# EAGLE design Pluvion 2 (EAGLE 7.3.0)

## Sheet 1 of 3
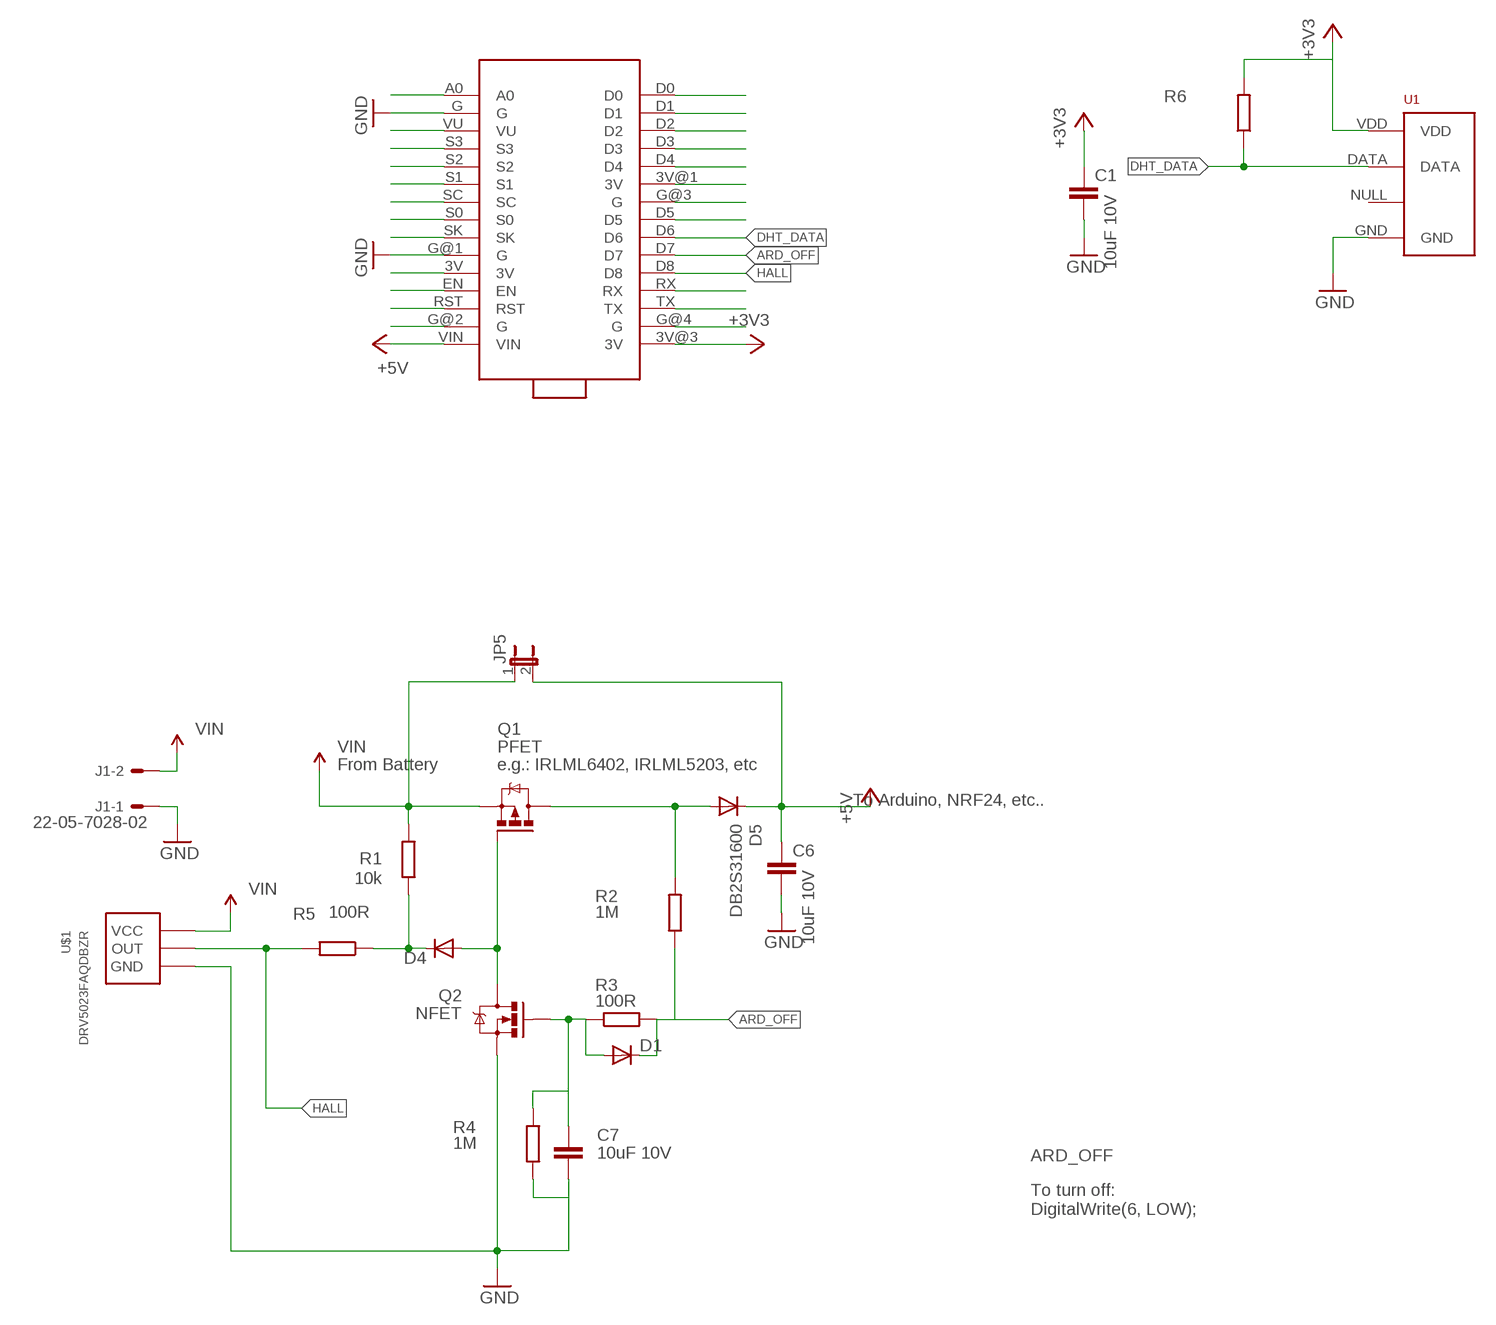
[diagram p0: schematic, sheet 1]

### Parts
C1  10uF 10V  C-EUC0805  [C0805]
C6  10uF 10V  C-EUC0805  [C0805]
C7  10uF 10V  C-EUC0805  [C0805]
D1  DIODESOD  [SOD-323]
D4  DIODESOD  [SOD-323]
D5  DB2S31600  DIODESMA  [SMA-DIODE]
J1  22-05-7028-02  [7395-02]
JP5  JUMPER-2PTH  [1X02]
Q1  PFET  IRLML5203  [MICRO3]
Q2  NFET  MOSFET-NCHANNELBSS123LT1G  [SOT23]
R1  10k  R-EU_R0805  [R0805]
R2  1M  R-EU_R0805  [R0805]
R3  100R  R-EU_R0805  [R0805]
R4  1M  R-EU_R0805  [R0805]
R5  100R  R-EU_R0805  [R0805]
R6  R-EU_R0805  [R0805]
U1  RHT03_DHT-22_AM2302RA  [RHT03_DHT-22/RA]
U$1  DRV5023FAQDBZR  [SOT23]
U$2  NODE-LOLIN-ESP8266  [NODE-LOLIN-ESP8266]

### Nets
+3V3: C1.1 R6.2 U1.VDD U$2.3V@3(3V)
+5V: C6.1 D5.C JP5.2 U$2.VIN
ARD_OFF: D1.1(C) R2.1 R3.2 U$2.D7
BUTTONS: D4.2(A) Q1.1(G) Q2.3(D)
DHT_DATA: R6.1 U1.DATA U$2.D6
GND: C1.2 C6.2 C7.2 J1.1 Q2.2(S) R4.1 U1.GND U$1.3(GND) U$2.G U$2.G@1(G)
HALL: R5.2 U$1.2(OUT) U$2.D8
N$1: D5.A Q1.3(D) R2.2
N$2: C7.1 D1.2(A) Q2.1(G) R3.1 R4.2
N$3: U$2.D0
N$4: U$2.D1
N$5: U$2.D2
N$6: U$2.D3
N$7: U$2.D4
N$8: D4.1(C) R1.1 R5.1
N$11: U$2.D5
N$12: U$2.G@3(G)
N$13: U$2.G@4(G)
N$14: U$2.3V@1(3V)
N$15: U$2.RX
N$16: U$2.TX
N$17: U$2.3V
N$19: U$2.A0
N$21: U$2.VU
N$22: U$2.S3
N$23: U$2.S2
N$24: U$2.S1
N$25: U$2.SC
N$26: U$2.S0
N$27: U$2.SK
N$30: U$2.EN
N$31: U$2.RST
N$32: U$2.G@2(G)
VIN: J1.2 JP5.1 Q1.2(S) R1.2 U$1.1(VCC)
Unconnected: U1.NULL

### Notes on the sheet
- From Battery | e.g.: IRLML6402, IRLML5203, etc
- To Arduino, NRF24, etc..
- To turn off:
  DigitalWrite(6, LOW);

## Sheet 2 of 3

## Sheet 3 of 3

## Library data of the parts
C1 C6 C7 = wes:C-EU: CAPACITOR, European symbol
D1 D4 = SparkFun-DiscreteSemi:DIODE: Diode These are standard reverse protection diodes and small signal diodes. SMA package can handle up to about 1A. SOD-323 can handle about 200mA. What the SOD-323 package when ordering, there are some mfgs out there that are 5-pin packages.; PROD_ID: DIO-09646
D5 = SparkFun-DiscreteSemi:DIODE: Diode These are standard reverse protection diodes and small signal diodes. SMA package can handle up to about 1A. SOD-323 can handle about 200mA. What the SOD-323 package when ordering, there are some mfgs out there that are 5-pin packages.
J1 = con-molex:22-?-02: CONNECTOR wire to board 2.54 mm (.1 inch) pitch header; OC_FARNELL: 9731601; OC_NEWARK: unknown
JP5 = SparkFun-Passives:JUMPER-2: Jumper Basic 0.1" spaced jumper. Use with breakaway headers.
Q1 = transistor-power:IRLML5203: HEXFET P-Channel Power MOSFET
Q2 = SparkFun-DiscreteSemi:MOSFET-NCHANNEL: Common NMOSFET Parts MFG P/N Store ID Prod ID FDD8780 TRANS-09984 SI7820DN TRANS-11055 FDS6630A IC-08089 2N7002PW TRANS-11151 FQP30N06L COM-10213 TRANS-10060 BSS123LT1G TRANS-08345 BSS138 TRANS-00830 BS170 2N7000; PROD_ID: TRANS-08345
R1-R6 = wes:R-EU_: RESISTOR, European symbol
U1 = RHT03_DHT-22_AM2302:RHT03_DHT-22_AM2302: RHT03 / DHT-22 / AM2302 Packages and symbol for the RHT03 / DHT-22 relative humidity and temperature sensor. Note: The AM2302 is a wired version of the DHT-22 which typically requires less clearance and is thus provided as a separate package.; PROD_ID: SEN-10167
U$1 = lib_pluvion:DRV5023FAQDBZR: Digital Switch Hall Sensor
U$2 = wes:NODE-LOLIN-ESP8266

## Board
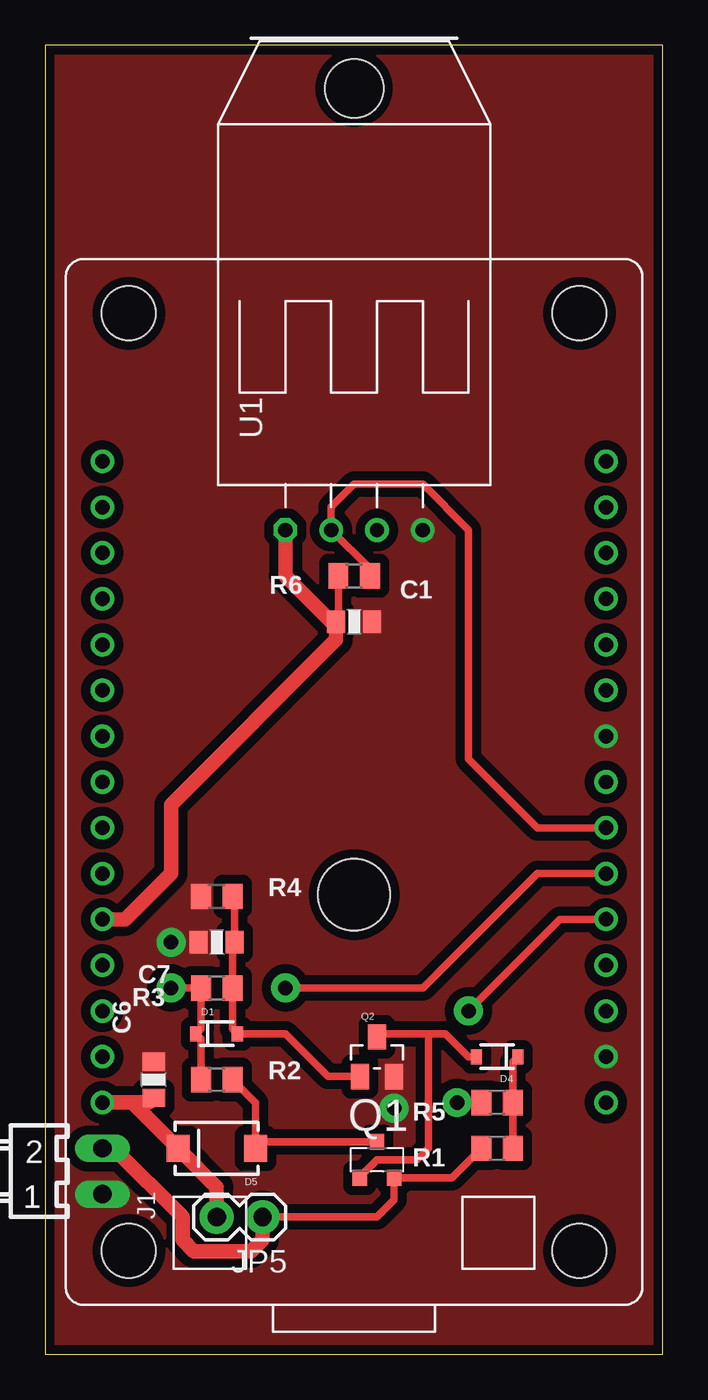
[diagram p1: board, top side]
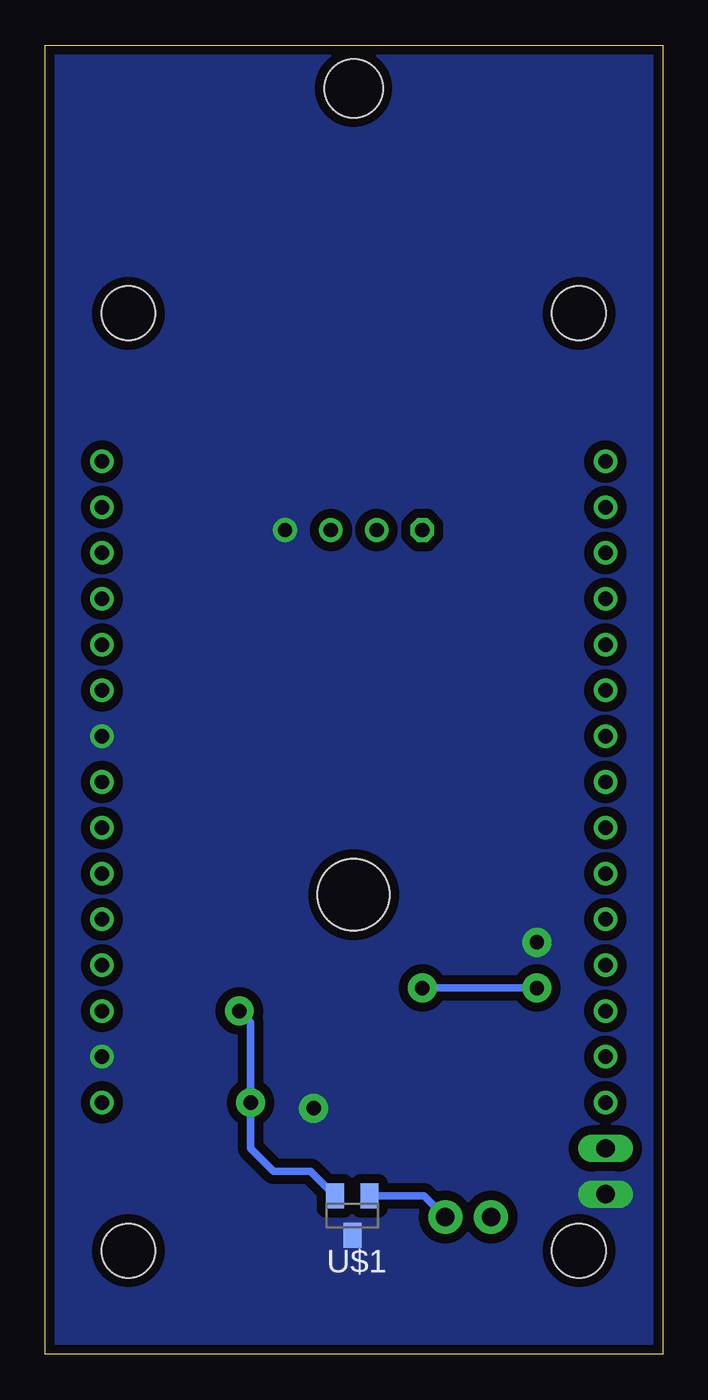
[diagram p2: board, bottom side, seen from below]

Size 34.27 x 72.62 mm. Coordinates in mm from the lower left corner, seen from the top.
Outline: 0,0 34.27,0 34.27,72.62 0,72.62 0,0
Copper layers (1*16): Top 0.035mm / dielectric 1.5mm / Bottom 0.035mm
Design rules "default *": minimum track width 10mil, minimum drill 0.6mm, track to track 8mil, track to pad 8mil, pad to pad 8mil, via to via 8mil, smd to smd 8mil, copper to edge 10mil, drill to drill 8mil, minimum pad ring 10mil, minimum via ring 8mil, stop-mask expansion 4mil, vias tented up to drill 0mil, thermal gap 10mil
Holes 4 mm at 17.14,25.5

### Footprints (pad centres in the part's own frame; a part is rotated, then mirrored left to right if it is on the bottom)
C0805 = smd 1 x 1.25: 1 -1,0; 2 1,0
SOD-323 = smd 0.63 x 0.83: 1 -1.15,0; 2 1.15,0
SMA-DIODE = smd 1.27 x 1.47: A -2.15,0; C 2.15,0
7395-02 = drill 1.016 long: 1 1.27,0; 2 -1.27,0
1X02 = drill 1.016 pad 1.88: 1 0,0; 2 2.54,0
MICRO3 = smd 0.8 x 0.9: 1 -0.95,-1; 2 0.95,-1; 3 0,1
SOT23 = smd 1 x 1.4: 1 -0.95,-1.1; 2 0.95,-1.1; 3 0,1.1
R0805 = smd 1.1 x 1.4: 1 -0.875,0; 2 0.875,0
RHT03_DHT-22/RA = drill 0.8: DATA -1.27,0; GND 3.81,0; NULL 1.27,0 | drill 0.8 octagon: VDD -3.81,0 | hole 3.25: 0,24.5
NODE-LOLIN-ESP8266 = drill 0.8: 3V -13.97,17.78; 3V@1 -13.97,-5.08; 3V@3 13.97,7.62; A0 13.97,-17.78; D0 -13.97,-17.78; D1 -13.97,-15.24; D2 -13.97,-12.7; D3 -13.97,-10.16; D4 -13.97,-7.62; D5 -13.97,0; D6 -13.97,2.54; D7 -13.97,5.08; D8 -13.97,7.62; EN 13.97,10.16; G -13.97,15.24; G@1 -13.97,-2.54; G@2 13.97,-15.24; G@3 13.97,5.08; G@4 13.97,15.24; RST 13.97,12.7; RX -13.97,10.16; S0 13.97,0; S1 13.97,-5.08; S2 13.97,-7.62; S3 13.97,-10.16; SC 13.97,-2.54; SK 13.97,2.54; TX -13.97,12.7; VIN 13.97,17.78; VU 13.97,-12.7 | hole 3: -12.5,26; 12.5,26; -12.5,-26; 12.5,-26

### Placement (x,y rotation side)
C1  17.14,40.64 0 top
C6  6.03,15.24 90 top
C7  9.53,22.86 180 top
D1  9.53,17.78 0 top
D4  25.08,16.51 180 top
D5  9.53,11.43 180 top
J1  3.17,10.16 270 top
JP5  12.06,7.62 180 top
Q1  18.41,10.79 0 top
Q2  18.41,16.51 0 top
R1  25.08,11.43 180 top
R2  9.53,15.24 0 top
R3  9.53,20.32 180 top
R4  9.53,25.4 0 top
R5  25.08,13.97 180 top
R6  17.14,43.18 180 top
U1  17.14,45.72 0 top
U$1  17.23,7.7 180 bottom
U$2  17.14,31.75 180 top

### Tracks (layer width: path | path; a pad name or v marks a point on that pad's centre or on a via)
+3V3
  Top 0.406: R6.2 16.27,40.77 C1.1
  Top 0.813: U1.VDD 13.34,43.18 15.88,40.64 C1.1 16.14,39.64 6.99,30.48 6.99,26.67 4.45,24.13 U$2.3V@3
+5V
  Top 0.813: U$2.VIN 4.83,13.97 | 4.83,13.97 D5.C 9.53,9.28 JP5.2 | 4.83,13.97 5.76,13.97 C6.1
ARD_OFF  (via drill 0.8 pad 1.6)
  Top 0.406: R2.1 8.65,17.5 D1.1 8.65,18.05 R3.2 v6.99,20.32 | U$2.D7 27.3,26.67 20.95,20.32 v13.34,20.32
  Bottom 0.406: v13.34,20.32 v6.99,20.32
BUTTONS
  Top 0.406: D4.2 23.5,16.51 22.23,17.78 21.27,17.78 | 21.27,17.78 18.59,17.78 Q2.3 | Q1.1 17.46,9.85 18.41,10.79 20.64,10.79 21.27,11.43 21.27,17.78
DHT_DATA
  Top 0.406: U$2.D6 27.3,29.21 23.5,33.02 23.5,45.72 20.95,48.26 17.14,48.26 15.88,46.99 U1.DATA 18.02,43.58 R6.1
GND  (via drill 0.8 pad 1.6)
  other vias: 19.37,13.65 6.99,22.86
  pour Top (isolate 0.508, no thermals): -10.16,73.66 90.17,73.66 90.17,-12.7 -10.16,-12.7
  pour Bottom (isolate 0.508, no thermals): -6.35,72.39 43.18,72.39 43.18,-12.7 -6.35,-12.7
HALL  (via drill 0.8 pad 1.6)
  Top 0.406: R5.2 v22.86,13.97 | U$2.D8 28.57,24.13 v23.5,19.05
  Bottom 0.406: U$1.2 19.54,10.16 21.59,10.16 22.86,11.43 v22.86,13.97 22.86,18.41 v23.5,19.05
N$1
  Top 0.406: Q1.3 12.04,11.79 D5.A 11.68,13.96 R2.2
N$2
  Top 0.406: R4.2 10.53,25.27 C7.1 10.4,22.73 R3.1 10.4,18.05 D1.2 13.34,17.78 15.71,15.41 Q2.1
N$8
  Top 0.406: R1.1 R5.1 25.96,16.23 D4.1
VIN
  Top 0.406: R1.2 22.57,9.79 Q1.2 19.36,8.57 18.41,7.62 JP5.1
  Top 0.813: J1.2 3.81,11.43 7.62,7.62 7.62,6.35 8.26,5.71 11.43,5.71 12.06,6.35 JP5.1
  Bottom 0.406: U$1.1 13.24,8.8 JP5.1